# EAGLE design SECONDARY_MODULE (EAGLE 8.4.3)
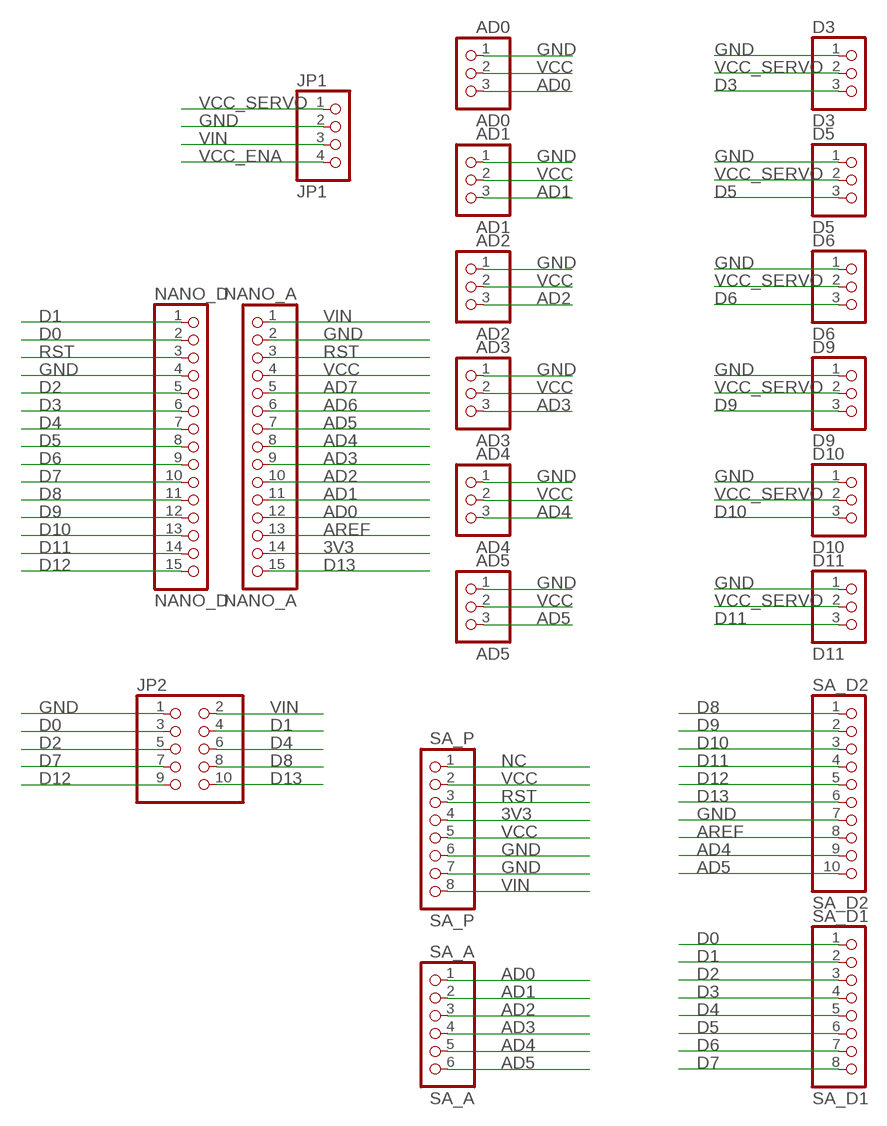
[diagram p0: schematic, sheet 1]

## Parts
AD0  AD0  PINHD-1X3  [1X03]
AD1  AD1  PINHD-1X3  [1X03]
AD2  AD2  PINHD-1X3  [1X03]
AD3  AD3  PINHD-1X3  [1X03]
AD4  AD4  PINHD-1X3  [1X03]
AD5  AD5  PINHD-1X3  [1X03]
D3  D3  PINHD-1X3  [1X03]
D5  D5  PINHD-1X3  [1X03]
D6  D6  PINHD-1X3  [1X03]
D9  D9  PINHD-1X3  [1X03]
D10  D10  PINHD-1X3  [1X03]
D11  D11  PINHD-1X3  [1X03]
JP1  JP1  PINHD-1X4  [1X04]
JP2  PINHD-2X5  [2X05]
NANO_A  NANO_A  PINHD-1X15  [1X15]
NANO_D  NANO_D  PINHD-1X15  [1X15]
SA_A  SA_A  PINHD-1X6  [1X06]
SA_D1  SA_D1  PINHD-1X8  [1X08]
SA_D2  SA_D2  PINHD-1X10  [1X10]
SA_P  SA_P  PINHD-1X8  [1X08]

## Nets
3V3: NANO_A.14 SA_P.4
AD0: AD0.3 NANO_A.12 SA_A.1
AD1: AD1.3 NANO_A.11 SA_A.2
AD2: AD2.3 NANO_A.10 SA_A.3
AD3: AD3.3 NANO_A.9 SA_A.4
AD4: AD4.3 NANO_A.8 SA_A.5 SA_D2.9
AD5: AD5.3 NANO_A.7 SA_A.6 SA_D2.10
AD6: NANO_A.6
AD7: NANO_A.5
AREF: NANO_A.13 SA_D2.8
D0: JP2.3 NANO_D.2 SA_D1.1
D1: JP2.4 NANO_D.1 SA_D1.2
D2: JP2.5 NANO_D.5 SA_D1.3
D3: D3.3 NANO_D.6 SA_D1.4
D4: JP2.6 NANO_D.7 SA_D1.5
D5: D5.3 NANO_D.8 SA_D1.6
D6: D6.3 NANO_D.9 SA_D1.7
D7: JP2.7 NANO_D.10 SA_D1.8
D8: JP2.8 NANO_D.11 SA_D2.1
D9: D9.3 NANO_D.12 SA_D2.2
D10: D10.3 NANO_D.13 SA_D2.3
D11: D11.3 NANO_D.14 SA_D2.4
D12: JP2.9 NANO_D.15 SA_D2.5
D13: JP2.10 NANO_A.15 SA_D2.6
GND: AD0.1 AD1.1 AD2.1 AD3.1 AD4.1 AD5.1 D3.1 D5.1 D6.1 D9.1 D10.1 D11.1 JP1.2 JP2.1 NANO_A.2 NANO_D.4 SA_D2.7 SA_P.6 SA_P.7
NC: SA_P.1
RST: NANO_A.3 NANO_D.3 SA_P.3
VCC: AD0.2 AD1.2 AD2.2 AD3.2 AD4.2 AD5.2 NANO_A.4 SA_P.2 SA_P.5
VCC_ENA: JP1.4
VCC_SERVO: D3.2 D5.2 D6.2 D9.2 D10.2 D11.2 JP1.1
VIN: JP1.3 JP2.2 NANO_A.1 SA_P.8

## Library data of the parts
AD0 AD1-AD5 D3 D5 D6 D9-D11 = pinhead:PINHD-1X3: PIN HEADER
JP1 = pinhead:PINHD-1X4: PIN HEADER
JP2 = pinhead:PINHD-2X5: PIN HEADER
NANO_A NANO_D = pinhead:PINHD-1X15: PIN HEADER
SA_A = pinhead:PINHD-1X6: PIN HEADER
SA_D1 SA_P = pinhead:PINHD-1X8: PIN HEADER
SA_D2 = pinhead:PINHD-1X10: PIN HEADER

## Board
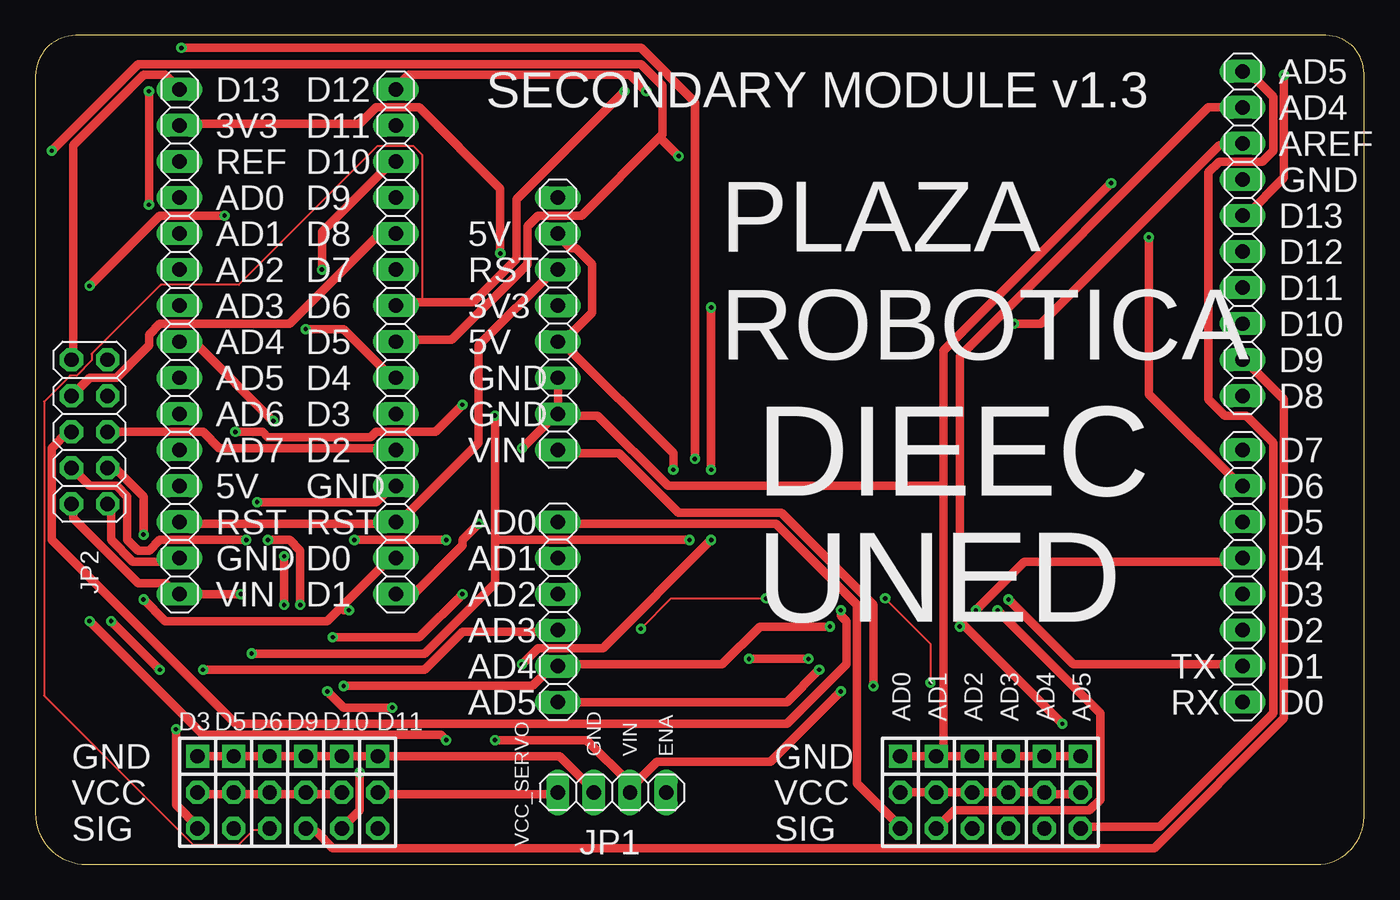
[diagram p1: board, top side]
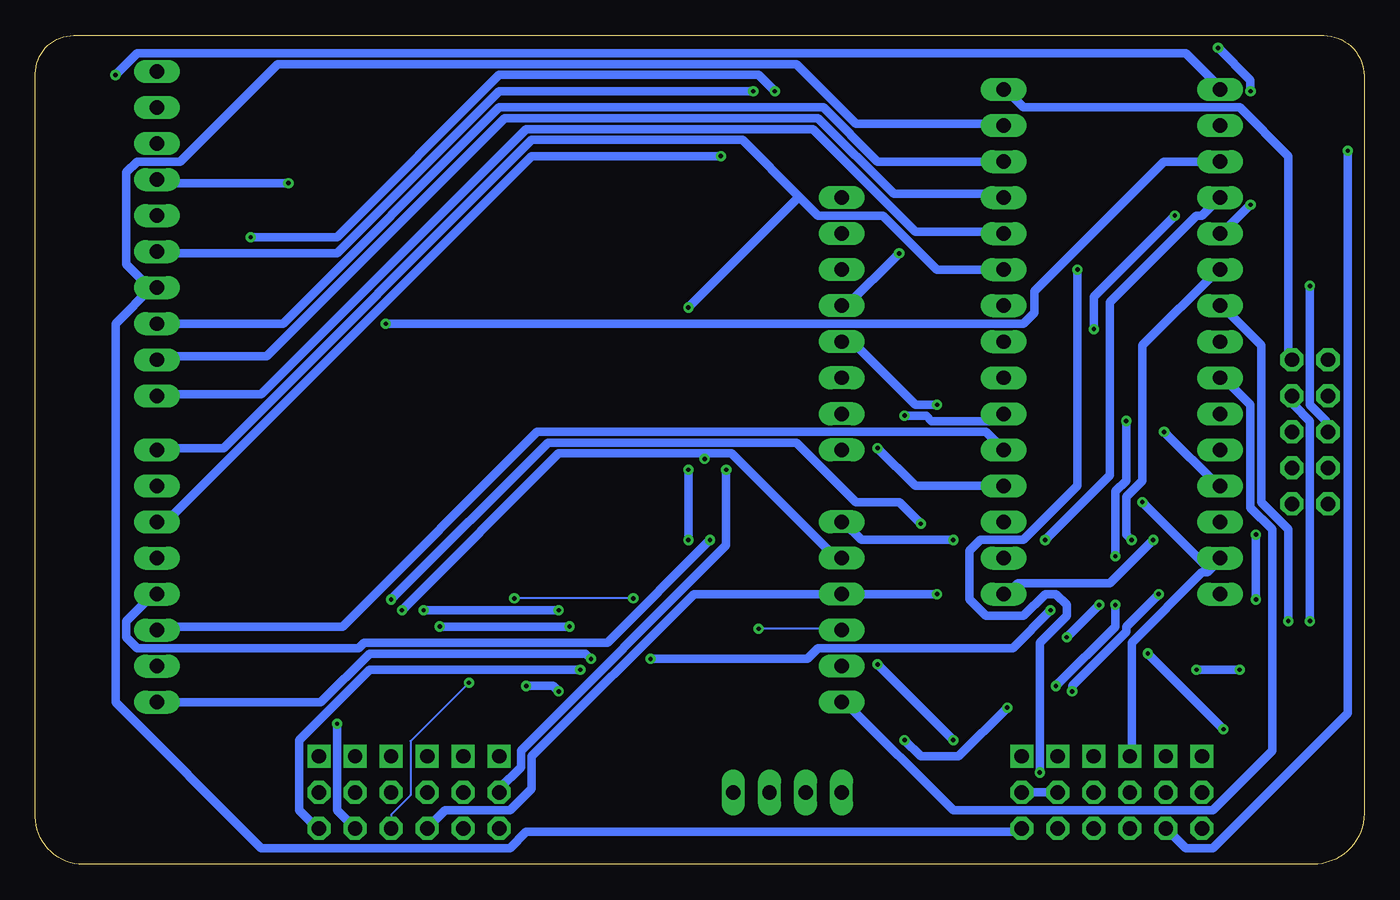
[diagram p2: board, bottom side, seen from below]

Size 93.65 x 58.41 mm. Coordinates in mm from the lower left corner, seen from the top.
Outline: 0,55.58 0,3.59 arc90 3.59,0 90.28,0 arc90 93.65,3.37 93.65,55.71 arc90 90.95,58.41 2.83,58.41 arc90 0,55.58
Copper layers (1*16): Top 0.035mm / dielectric 1.5mm / Bottom 0.035mm
Design rules "DFRobot_Eagle_Rule_v0.4": minimum track width 6mil, minimum drill 12mil, track to track 6mil, track to pad 6mil, pad to pad 6mil, via to via 6mil, smd to smd 0mil, copper to edge 10mil, drill to drill 10mil, minimum pad ring 12mil, minimum via ring 8mil, stop-mask expansion 2mil, vias tented up to drill 25mil, thermal gap 10mil

### Footprints (pad centres in the part's own frame; a part is rotated, then mirrored left to right if it is on the bottom)
1X03 = drill 1.016 square: 1 -2.54,0 | drill 1.016 octagon: 2 0,0; 3 2.54,0
1X04 = drill 1.016 long: 1 -3.81,0; 2 -1.27,0; 3 1.27,0; 4 3.81,0
2X05 = drill 1.016 octagon: 1 -5.08,-1.27; 2 -5.08,1.27; 3 -2.54,-1.27; 4 -2.54,1.27; 5 0,-1.27; 6 0,1.27; 7 2.54,-1.27; 8 2.54,1.27; 9 5.08,-1.27; 10 5.08,1.27
1X15 = drill 1.016 long: 1 -17.78,0; 2 -15.24,0; 3 -12.7,0; 4 -10.16,0; 5 -7.62,0; 6 -5.08,0; 7 -2.54,0; 8 0,0; 9 2.54,0; 10 5.08,0; 11 7.62,0; 12 10.16,0; 13 12.7,0; 14 15.24,0; 15 17.78,0
1X06 = drill 1.016 long: 1 -6.35,0; 2 -3.81,0; 3 -1.27,0; 4 1.27,0; 5 3.81,0; 6 6.35,0
1X08 = drill 1.016 long: 1 -8.89,0; 2 -6.35,0; 3 -3.81,0; 4 -1.27,0; 5 1.27,0; 6 3.81,0; 7 6.35,0; 8 8.89,0
1X10 = drill 1.016 long: 1 -11.43,0; 2 -8.89,0; 3 -6.35,0; 4 -3.81,0; 5 -1.27,0; 6 1.27,0; 7 3.81,0; 8 6.35,0; 9 8.89,0; 10 11.43,0

### Placement (x,y rotation side)
AD0  60.96,5.08 270 top
AD1  63.5,5.08 270 top
AD2  66.04,5.08 270 top
AD3  68.58,5.08 270 top
AD4  71.12,5.08 270 top
AD5  73.66,5.08 270 top
D3  11.43,5.08 270 top
D5  13.97,5.08 270 top
D6  16.51,5.08 270 top
D9  19.05,5.08 270 top
D10  21.59,5.08 270 top
D11  24.13,5.08 270 top
JP1  40.64,5.08 0 top
JP2  3.81,30.48 90 top
NANO_A  10.16,36.83 90 top
NANO_D  25.4,36.83 90 top
SA_A  36.83,17.78 270 top
SA_D1  85.09,20.32 90 top
SA_D2  85.09,44.45 90 top
SA_P  36.83,38.1 270 top

### Tracks (layer width: path | path; a pad name or v marks a point on that pad's centre or on a via)
3V3  (via drill 0.3)
  Top 0.61: v32.77,43.05 32.77,47.62 27.05,53.34 24,53.34 22.86,52.2 10.29,52.2 NANO_A.14
  Bottom 0.61: v32.77,43.05 36.58,39.24 SA_P.4
AD0  (via drill 0.3)
  Top 0.61: v28.96,22.86 v22.48,22.86 | AD0.3 60.96,2.67 57.91,5.71 57.91,18.29 52.2,24 36.96,24 SA_A.1
  Bottom 0.61: NANO_A.12 11.43,45.72 11.81,45.72 17.91,39.62 17.91,27.43 v22.48,22.86 | v28.96,22.86 35.43,22.86 36.58,24 SA_A.1
AD1  (via drill 0.3)
  Top 0.61: AD1.3 64.77,3.81 74.3,3.81 75.06,4.57 75.06,10.67 v67.82,17.91 | v8,54.48 v8,46.48 | v10.29,57.53 42.67,57.53 46.48,53.72 v46.48,28.57
  Bottom 0.61: v67.82,17.91 56.77,28.96 46.48,28.96 | 46.48,28.96 44.58,28.96 36.96,21.34 SA_A.2 | v8,46.48 9.91,44.58 NANO_A.11 | v8,54.48 8,55.24 v10.29,57.53 | 46.48,28.96 v46.48,28.57
AD2  (via drill 0.3)
  Top 0.61: v16.38,22.86 17.91,22.86 18.67,22.1 v18.67,18.29 | v20.95,16 27.05,16 v30.1,19.05
  Bottom 0.61: AD2.3 64.77,3.81 60.2,3.81 58.67,5.33 58.67,7.62 47.24,19.05 SA_A.3 v30.1,19.05 | v16.38,22.86 16.76,23.24 16.76,25.91 15.62,27.05 15.62,36.58 10.29,41.91 NANO_A.10 | v20.95,16 v18.67,18.29
AD3  (via drill 0.3)
  Top 0.152: v63.09,12.8 63.09,15.54 v59.89,18.75 | v51.51,18.75 44.81,18.75 v42.67,16.61
  Top 0.61: v11.81,13.72 27.43,13.72 30.1,16.38 36.58,16.38 SA_A.4 | v5.33,17.14 v8.76,13.72
  Bottom 0.152: AD3.3 68.58,3.5 67.21,4.88 67.21,8.69 v63.09,12.8 | v51.51,18.75 v59.89,18.75 | v42.67,16.61 36.88,16.61 SA_A.4
  Bottom 0.61: v8.76,13.72 v11.81,13.72 | v5.33,17.14 5.33,23.62 7.24,25.53 7.24,36.58 9.91,39.24 NANO_A.9
AD4  (via drill 0.3)
  Top 0.61: 65.34,16.95 65.15,17.14 65.15,35.81 82.68,53.34 SA_D2.9 | 65.34,16.95 v72.39,9.91 | v56.01,16.76 51.05,16.76 48.39,14.1 36.96,14.1 SA_A.5 36.58,14.1 35.05,12.57 v21.72,12.57 | v65.15,16.76 65.34,16.95 | v16.76,31.24 11.43,36.58 10.29,36.58 NANO_A.8 | v17.53,18.29 v17.53,21.72
  Bottom 0.61: AD4.3 72.39,3.81 v72.39,9.91 | v65.15,16.76 v56.01,16.76 | v16.76,31.24 16.76,27.05 17.53,26.29 v17.53,21.72 | v17.53,18.29 17.53,16.76 v21.72,12.57
AD5  (via drill 0.3)
  Top 0.61: AD5.3 73.91,2.67 79.25,2.67 87.25,10.67 87.25,29.72 85.34,31.62 83.82,31.62 82.68,32.77 82.68,48.77 83.44,49.53 86.49,49.53 87.25,50.29 87.25,54.1 85.34,56.01 SA_D2.10 | SA_A.6 52.96,11.43 v55.24,13.72
  Bottom 0.61: SA_A.6 36.58,11.43 28.96,3.81 10.67,3.81 6.48,8 6.48,23.62 8,25.15 8,32.38 9.91,34.29 NANO_A.7 | v55.24,13.72 70.1,13.72 75.06,8.76 75.06,3.81 73.91,2.67 AD5.3
AREF  (via drill 0.3)
  Top 0.61: v68.96,38.1 70.87,38.1 83.44,50.67 84.96,50.67 SA_D2.8
  Bottom 0.61: NANO_A.13 14.1,49.53 23.24,40.39 23.24,38.86 24,38.1 v68.96,38.1
D0  (via drill 0.3)
  Top 0.61: v7.62,23.24 7.62,25.91 5.71,27.81 5.33,27.81 JP2.3 | v7.62,18.67 9.14,17.14 20.57,17.14 21.53,18.1 | 21.53,18.1 25.15,21.72 NANO_D.2 | v50.29,14.48 v54.48,14.48 | v22.1,17.91 21.72,17.91 21.53,18.1
  Bottom 0.61: v7.62,18.67 v7.62,23.24 | SA_D1.1 73.53,11.43 70.1,14.86 54.86,14.86 v54.48,14.48 | v50.29,14.48 39.24,14.48 38.48,15.24 24.77,15.24 v22.1,17.91
D1  (via drill 0.3)
  Top 0.61: JP2.4 3.81,26.67 5.71,26.67 6.48,25.91 6.48,22.86 7.24,22.1 8,22.1 8.76,22.86 v14.86,22.86 | v68.58,18.67 73.15,14.1 84.96,14.1 SA_D1.2 | v31.24,24 30.1,22.86 30.1,22.48 26.67,19.05 NANO_D.1
  Bottom 0.61: v14.86,22.86 17.91,19.81 24.38,19.81 25.15,19.05 NANO_D.1 | v68.58,18.67 57.53,29.72 40.01,29.72 35.81,25.53 32.77,25.53 v31.24,24
D2
  Top 0.61: JP2.5 11.81,30.48 12.95,29.34 25.15,29.34 NANO_D.5
  Bottom 0.61: NANO_D.5 26.67,30.48 58.29,30.48 72.01,16.76 84.96,16.76 SA_D1.3
D3  (via drill 0.3)
  Top 0.61: v9.91,9.53 9.91,4.19 11.43,2.67 D3.3 | v15.24,14.86 27.43,14.86 32.38,19.81 32.38,22.86 | v32.38,31.62 32.38,22.86 | 32.38,22.86 v46.1,22.86
  Bottom 0.61: v15.24,14.86 v9.91,9.53 | v32.38,31.62 30.86,31.62 30.48,31.24 25.91,31.24 NANO_D.6 | v46.1,22.86 53.34,15.62 70.48,15.62 70.87,15.24 86.49,15.24 87.25,16 87.25,17.14 85.34,19.05 SA_D1.4
D4  (via drill 0.3)
  Top 0.61: v3.81,40.77 8.76,45.72 v13.34,45.72 | v19.05,37.72 21.72,37.72 25.15,34.29 NANO_D.7 | v66.29,17.91 69.72,21.34 84.96,21.34 SA_D1.5 | v56.77,17.91 56.77,17.53 57.15,17.14 57.15,14.1 52.96,9.91 14.1,9.91 1.14,22.86 1.14,29.34 2.29,30.48 JP2.6
  Bottom 0.61: v3.81,40.77 3.81,32.38 2.67,31.24 2.67,30.48 JP2.6 | v13.34,45.72 19.05,40.01 v19.05,37.72 | v56.77,17.91 v66.29,17.91
D5  (via drill 0.3)
  Top 0.61: v1.14,50.29 7.24,56.39 42.67,56.39 44.2,54.86 44.2,51.44 44.01,51.24 | 44.01,51.24 38.48,45.72 35.43,45.72 34.67,44.96 34.67,42.29 29.34,36.96 25.53,36.96 NANO_D.8 | 44.01,51.24 v45.34,49.91
  Bottom 0.61: D5.3 12.57,1.14 10.67,1.14 1.14,10.67 v1.14,50.29 | v45.34,49.91 58.67,49.91 84.2,24.38 84.96,24.38 SA_D1.6
D6  (via drill 0.3)
  Top 0.152: 27.28,39.62 27.28,49.99 26.67,50.6 24.08,50.6 14.33,40.84 8.84,40.84 3.96,35.97 3.96,35.51 2.9,34.44 2.44,34.44 0.61,32.61 0.61,11.89 11.12,1.37 14.33,1.37 15.39,2.44 16.46,2.44 D6.3
  Top 0.61: v78.49,44.2 78.49,33.15 84.96,26.67 SA_D1.7 | v41.53,54.48 33.91,46.86 33.91,42.67 30.86,39.62 27.28,39.62 25.53,39.62 NANO_D.9
  Bottom 0.61: v78.49,44.2 72.39,44.2 60.96,55.63 42.67,55.63 v41.53,54.48
D7  (via drill 0.3)
  Top 0.61: v3.81,17.14 11.81,9.14 28.57,9.14 v28.96,8.76 | v34.29,14.1 35.43,15.24 40.01,15.24 v47.62,22.86 | v47.62,39.24 v47.62,27.81
  Bottom 0.61: 39.81,47.05 38.48,45.72 33.91,45.72 30.1,41.91 NANO_D.10 | 39.81,47.05 43.81,51.05 58.67,51.05 80.39,29.34 84.96,29.34 SA_D1.8 | v3.81,17.14 3.81,31.24 4.95,32.38 4.95,32.77 JP2.7 | v34.29,14.1 v28.96,8.76 | v47.62,27.81 v47.62,22.86 | 39.81,47.05 v47.62,39.24
D8
  Top 0.61: JP2.8 3.81,34.29 5.71,34.29 8,36.58 8,37.34 8.76,38.1 17.91,38.1 24,44.2 25.15,44.2 NANO_D.11
  Bottom 0.61: SA_D2.1 84.96,33.15 77.72,33.15 59.05,51.82 38.86,51.82 31.62,44.58 25.53,44.58 NANO_D.11
D9
  Top 0.61: D9.3 19.05,2.29 19.81,2.29 20.95,1.14 78.87,1.14 88.01,10.29 88.01,32.77 85.34,35.43 SA_D2.2
  Bottom 0.61: NANO_D.12 25.53,47.24 33.15,47.24 38.48,52.58 60.58,52.58 77.34,35.81 84.96,35.81 SA_D2.2
D10  (via drill 0.3)
  Top 0.61: D10.3 22.86,3.81 v22.86,6.48 | v20.19,41.91 20.19,44.58 25.15,49.53 NANO_D.13
  Bottom 0.61: v22.86,6.48 22.86,15.62 20.95,17.53 20.95,18.29 21.72,19.05 22.48,19.05 24,17.53 26.67,17.53 27.81,18.67 27.81,22.1 27.05,22.86 24,22.86 20.19,26.67 v20.19,41.91 | SA_D2.3 76.2,38.1 60.96,53.34 38.1,53.34 34.29,49.53 NANO_D.13
D11
  Bottom 0.61: D11.3 24.38,2.29 59.05,2.29 60.2,1.14 77.72,1.14 88.01,11.43 88.01,38.1 85.34,40.77 SA_D2.4 85.72,40.77 87.25,42.29 87.25,48.77 86.49,49.53 83.44,49.53 76.58,56.39 40.01,56.39 35.81,52.2 25.53,52.2 NANO_D.14
D12  (via drill 0.3)
  Top 0.61: v43.05,54.48 41.91,55.63 26.29,55.63 25.53,54.86 NANO_D.15
  Bottom 0.61: JP2.9 5.33,35.81 5.33,49.91 8.76,53.34 24,53.34 25.15,54.48 NANO_D.15 | v43.05,54.48 60.96,54.48 72.39,43.05 84.96,43.05 SA_D2.5
D13  (via drill 0.3)
  Top 0.61: NANO_A.15 9.14,55.63 7.62,55.63 2.67,50.67 2.67,35.81 JP2.10 | v88.01,55.63 88.01,48.39 85.34,45.72 SA_D2.6
  Bottom 0.61: v88.01,55.63 86.49,57.15 12.57,57.15 10.29,54.86 NANO_A.15
GND  (via drill 0.3)
  Top 0.61: AD0.1 AD1.1 64.01,7.62 | 64.01,7.62 AD2.1 AD3.1 AD4.1 AD5.1 | SA_P.7 SA_P.6 | NANO_A.2 9.91,21.34 6.86,21.34 5.33,22.86 5.33,25.15 JP2.1 | D3.1 D5.1 D6.1 D9.1 D10.1 D11.1 36.96,7.62 39.24,5.33 JP1.2 | v34.29,29.34 36.58,31.62 SA_P.7 | v75.82,48.01 64.01,36.2 64.01,26.67 | 64.01,7.62 64.01,26.67 | 64.01,26.67 44.58,26.67 39.62,31.62 36.96,31.62 SA_P.7 | v15.62,25.53 24,25.53 25.15,26.67 NANO_D.4
  Bottom 0.61: D6.1 16.38,7.62 16.38,15.62 11.43,20.57 11.05,20.57 10.29,21.34 NANO_A.2 11.05,20.95 v15.62,25.53 | NANO_D.4 31.62,26.67 v34.29,29.34 | v75.82,48.01 84.96,48.01 SA_D2.7
RST
  Top 0.61: NANO_A.3 10.29,24 25.15,24 NANO_D.3 25.53,24 31.24,29.72 31.24,36.58 36.58,41.91 SA_P.3
VCC  (via drill 0.3)
  Top 0.61: AD0.2 AD1.2 AD2.2 AD3.2 AD4.2 71.25,4.95 73.53,4.95 AD5.2 | v14.1,30.48 16,30.48 16.38,30.1 23.62,30.1 24,30.48 28.19,30.48 v30.1,32.38 | SA_P.2 36.96,44.2 37.72,43.43 38.1,43.43 39.24,42.29 39.24,38.86 36.96,36.58 SA_P.5 37.34,36.58 44.96,28.96 v44.96,27.81
  Bottom 0.61: v14.1,30.48 10.29,26.67 NANO_A.4 | v30.1,32.38 31.62,32.38 35.81,36.58 36.58,36.58 SA_P.5 | v44.96,27.81 44.96,22.48 59.44,8 59.44,6.86 60.96,5.33 AD0.2
VCC_SERVO
  Top 0.61: D3.2 11.43,4.95 13.72,4.95 D5.2 14.1,4.95 16.38,4.95 D6.2 16.76,4.95 19.05,4.95 | JP1.1 36.58,4.95 24.38,4.95 D11.2 | 19.05,4.95 21.34,4.95 D10.2 | 19.05,4.95 D9.2
  Bottom 0.61: D10.2 D11.2
VIN  (via drill 0.3)
  Top 0.61: JP2.2 2.67,25.15 2.67,24.38 7.24,19.81 9.14,19.81 9.91,19.05 NANO_A.1 v14.48,19.05 | v59.05,12.57 59.05,18.29 52.58,24.77 45.34,24.77 41.15,28.96 36.96,28.96 SA_P.8 | v56.77,12.19 51.82,7.24 43.81,7.24 41.91,5.33 JP1.3 41.91,5.71 38.86,8.76 v32.38,8.76 | v20.57,12.19 21.72,11.05 v25.15,11.05
  Bottom 0.61: v59.05,12.57 57.15,12.57 v56.77,12.19 | v14.48,19.05 16.76,16.76 16.76,16.38 20.57,12.57 v20.57,12.19 | v25.15,11.05 28.57,7.62 31.24,7.62 v32.38,8.76

### Text on the board
tNames: AD5 | D13 | D12 | SECONDARY MODULE v1.3 | AD4 | 3V3 | D11 | AREF | REF | D10 | GND | AD0 | D9 | D13 | AD1 | D8 | 5V | D12 | AD2 | D7 | RST | PLAZA / ROBOTICA | D11 | AD3 | D6 | 3V3 | D10 | AD4 | D5 | 5V | D9 | AD5 | D4 | GND | D8 | AD6 | D3 | GND | AD7 | D2 | VIN | DIEEC | D7 | 5V | GND | D6 | RST | RST | AD0 | D5 | GND | D0 | AD1 | D4 | UNED | VIN | D1 | AD2 | D3 | AD3 | D2 | AD4 | TX | D1 | AD5 | RX | D0 | GND | GND | VIN | ENA | GND | VCC | VCC | SIG | SIG | VCC_SERVO